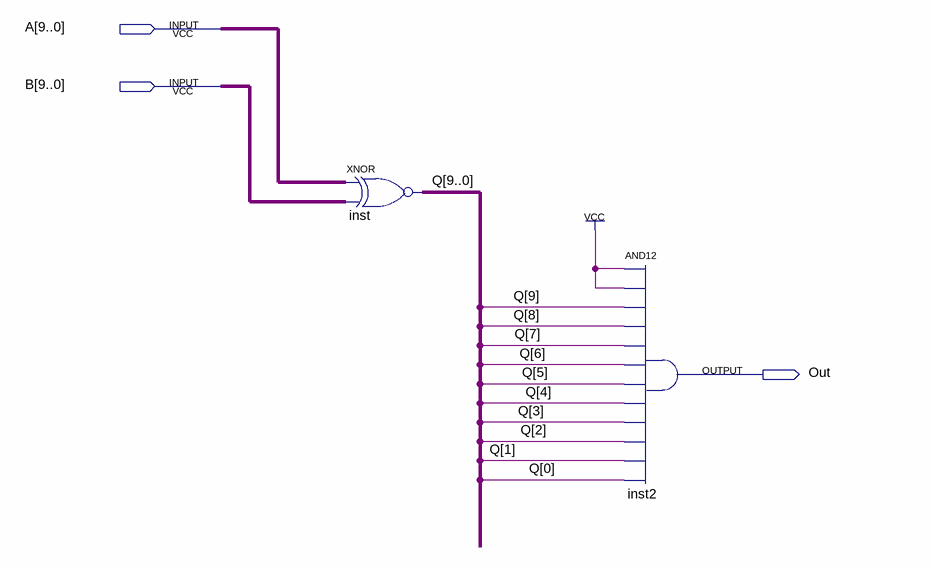
[diagram p0: schematic sheet]
// Quartus schematic EQUAL.bdf as structural Verilog: 2 symbols, 3 pins
module EQUAL (
  input  [9:0] A,
  input  [9:0] B,
  output Out
);

  wire [9:0] Q;

  assign Q = ~(A ^ B);  // XNOR inst, 10 bits wide
  and inst2 (Out, 1'b1, 1'b1, Q[9], Q[8], Q[7], Q[6], Q[5], Q[4], Q[3], Q[2], Q[1], Q[0]);
endmodule
